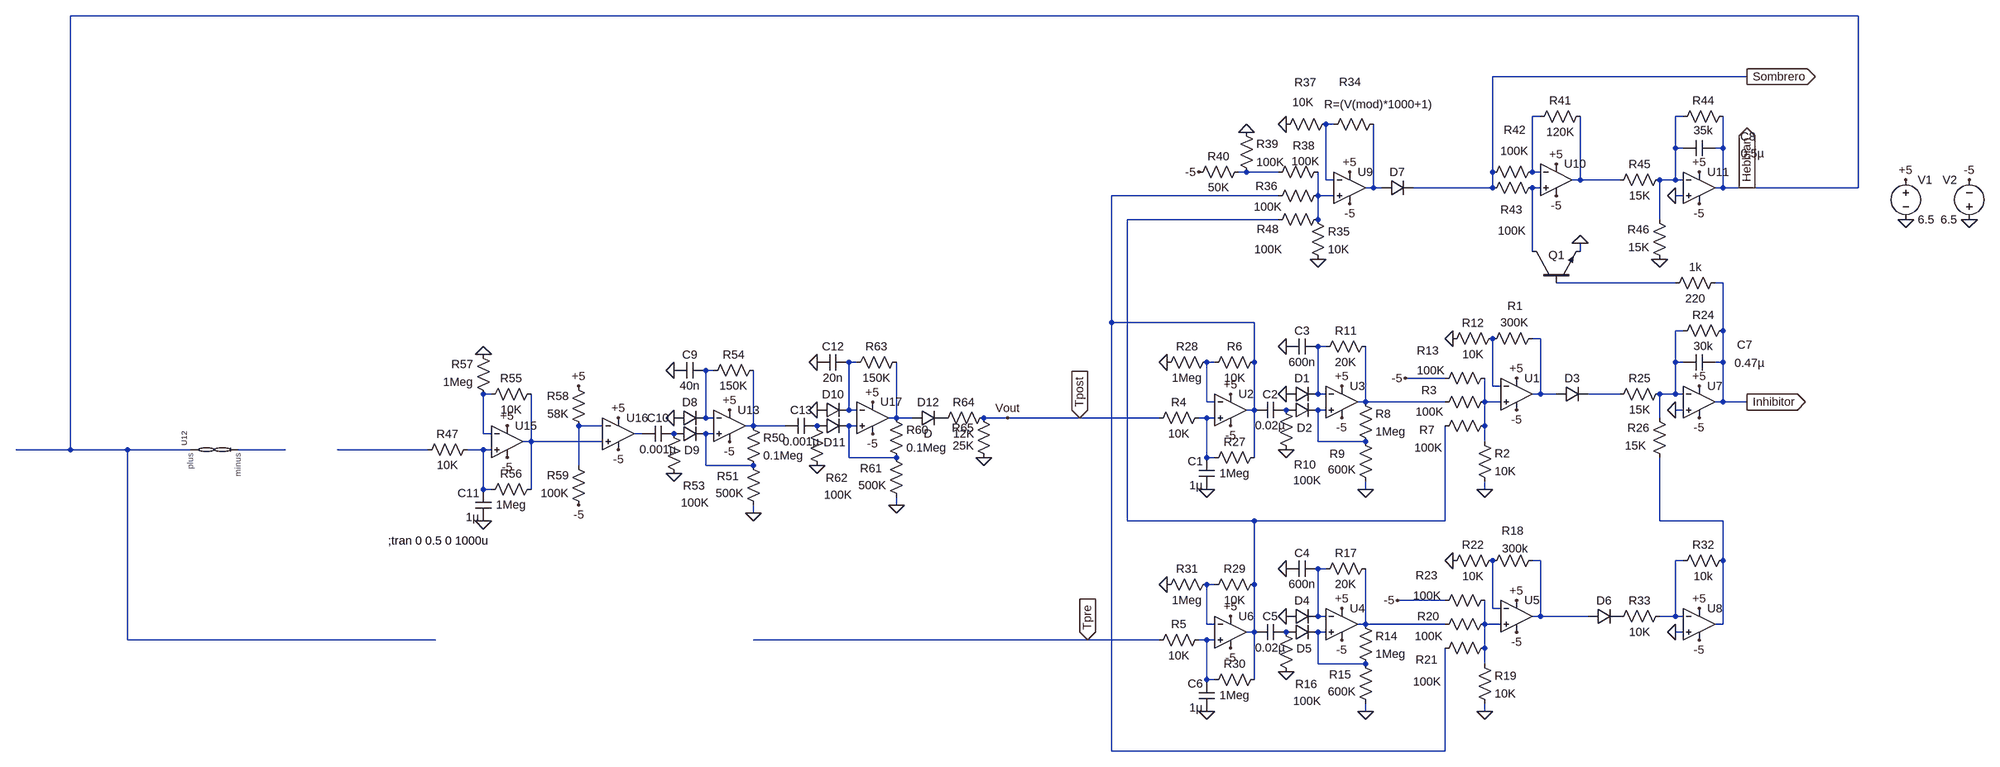
[diagram p0: schematic united_model.asc]
united_model.asc, the LTspice schematic file:
Version 4
SHEET 1 2036 680
WIRE 144 -1360 -4192 -1360
WIRE -80 -944 -592 -944
WIRE -496 -864 -512 -864
WIRE -208 -864 -224 -864
WIRE -912 -848 -928 -848
WIRE -224 -800 -224 -864
WIRE -208 -800 -224 -800
WIRE -128 -800 -128 -864
WIRE -128 -800 -144 -800
WIRE -1088 -752 -1104 -752
WIRE -1024 -752 -1088 -752
WIRE -592 -752 -592 -944
WIRE -512 -752 -512 -864
WIRE -496 -752 -512 -752
WIRE -928 -736 -928 -848
WIRE -912 -736 -928 -736
WIRE -416 -736 -416 -864
WIRE -416 -736 -432 -736
WIRE -336 -736 -416 -736
WIRE -224 -736 -224 -800
WIRE -224 -736 -256 -736
WIRE -208 -736 -224 -736
WIRE -832 -720 -832 -848
WIRE -832 -720 -848 -720
WIRE -816 -720 -832 -720
WIRE -592 -720 -592 -752
WIRE -592 -720 -752 -720
WIRE -496 -720 -512 -720
WIRE -128 -720 -128 -800
WIRE -128 -720 -144 -720
WIRE -80 -720 -128 -720
WIRE 144 -720 144 -1360
WIRE 144 -720 -80 -720
WIRE -1024 -704 -1360 -704
WIRE -944 -704 -944 -752
WIRE -912 -704 -944 -704
WIRE -208 -704 -224 -704
WIRE -1024 -656 -1328 -656
WIRE -944 -656 -944 -704
WIRE -256 -656 -256 -736
WIRE -512 -592 -512 -720
WIRE -416 -592 -416 -608
WIRE -224 -528 -464 -528
WIRE -128 -528 -144 -528
WIRE -1360 -448 -1360 -704
WIRE -1072 -448 -1360 -448
WIRE -208 -432 -224 -432
WIRE -128 -432 -128 -528
WIRE -496 -416 -512 -416
WIRE -928 -400 -944 -400
WIRE -2080 -368 -2096 -368
WIRE -1152 -368 -1168 -368
WIRE -1072 -368 -1072 -448
WIRE -224 -368 -224 -432
WIRE -208 -368 -224 -368
WIRE -128 -368 -128 -432
WIRE -128 -368 -144 -368
WIRE -2368 -352 -2384 -352
WIRE -688 -336 -768 -336
WIRE -592 -320 -592 -416
WIRE -576 -320 -592 -320
WIRE -2816 -304 -2832 -304
WIRE -944 -304 -944 -400
WIRE -928 -304 -944 -304
WIRE -496 -304 -496 -416
WIRE -496 -304 -512 -304
WIRE -464 -304 -496 -304
WIRE -336 -304 -400 -304
WIRE -224 -304 -224 -368
WIRE -224 -304 -256 -304
WIRE -208 -304 -224 -304
WIRE -1168 -288 -1168 -368
WIRE -1152 -288 -1168 -288
WIRE -848 -288 -848 -400
WIRE -848 -288 -864 -288
WIRE -688 -288 -848 -288
WIRE -608 -288 -608 -336
WIRE -576 -288 -608 -288
WIRE -128 -288 -128 -368
WIRE -128 -288 -144 -288
WIRE -80 -288 -128 -288
WIRE -2096 -272 -2096 -368
WIRE -2080 -272 -2096 -272
WIRE -1072 -272 -1072 -368
WIRE -1072 -272 -1088 -272
WIRE -928 -272 -944 -272
WIRE -208 -272 -224 -272
WIRE -2384 -256 -2384 -352
WIRE -2368 -256 -2384 -256
WIRE -2000 -256 -2000 -368
WIRE -2000 -256 -2016 -256
WIRE -1968 -256 -2000 -256
WIRE -1776 -256 -1824 -256
WIRE -1424 -256 -1776 -256
WIRE -1264 -256 -1424 -256
WIRE -1168 -256 -1184 -256
WIRE -1152 -256 -1168 -256
WIRE -256 -256 -256 -304
WIRE -2592 -240 -2640 -240
WIRE -2288 -240 -2288 -352
WIRE -2288 -240 -2304 -240
WIRE -2224 -240 -2288 -240
WIRE -2080 -240 -2096 -240
WIRE -608 -240 -608 -288
WIRE -2832 -224 -2832 -304
WIRE -2816 -224 -2832 -224
WIRE -2512 -224 -2528 -224
WIRE -2368 -224 -2384 -224
WIRE -2736 -208 -2736 -304
WIRE -2736 -208 -2752 -208
WIRE -2592 -208 -2736 -208
WIRE -944 -208 -944 -272
WIRE -848 -208 -944 -208
WIRE -608 -208 -608 -240
WIRE -4192 -192 -4192 -1360
WIRE -4192 -192 -4944 -192
WIRE -3936 -192 -4192 -192
WIRE -3744 -192 -3936 -192
WIRE -3552 -192 -3648 -192
WIRE -2944 -192 -3280 -192
WIRE -2832 -192 -2864 -192
WIRE -2816 -192 -2832 -192
WIRE -2096 -176 -2096 -240
WIRE -2000 -176 -2096 -176
WIRE -1168 -176 -1168 -256
WIRE -1152 -176 -1168 -176
WIRE -1072 -176 -1072 -272
WIRE -2640 -160 -2640 -240
WIRE -2384 -160 -2384 -224
WIRE -2288 -160 -2384 -160
WIRE -2832 -112 -2832 -192
WIRE -2816 -112 -2832 -112
WIRE -2736 -112 -2736 -208
WIRE -848 -112 -848 -128
WIRE -608 -112 -608 -128
WIRE -2000 -80 -2000 -96
WIRE -2288 -64 -2288 -80
WIRE -1328 -48 -1328 -656
WIRE -1072 -48 -1328 -48
WIRE -688 -48 -688 -240
WIRE -688 -48 -1072 -48
WIRE -256 -48 -256 -176
WIRE -128 -48 -256 -48
WIRE -496 32 -512 32
WIRE -208 32 -224 32
WIRE -128 32 -128 -48
WIRE -928 48 -944 48
WIRE -1152 80 -1168 80
WIRE -1072 80 -1072 -48
WIRE -688 112 -784 112
WIRE -592 128 -592 32
WIRE -576 128 -592 128
WIRE -944 144 -944 48
WIRE -928 144 -944 144
WIRE -496 144 -496 32
WIRE -496 144 -512 144
WIRE -400 144 -496 144
WIRE -224 144 -224 32
WIRE -224 144 -256 144
WIRE -208 144 -224 144
WIRE -1168 160 -1168 80
WIRE -1152 160 -1168 160
WIRE -848 160 -848 48
WIRE -848 160 -864 160
WIRE -688 160 -848 160
WIRE -608 160 -608 112
WIRE -576 160 -608 160
WIRE -128 160 -128 32
WIRE -128 160 -144 160
WIRE -1072 176 -1072 80
WIRE -1072 176 -1088 176
WIRE -928 176 -944 176
WIRE -208 176 -224 176
WIRE -3936 192 -3936 -192
WIRE -2928 192 -3936 192
WIRE -1408 192 -2288 192
WIRE -1264 192 -1408 192
WIRE -1168 192 -1184 192
WIRE -1152 192 -1168 192
WIRE -608 208 -608 160
WIRE -944 240 -944 176
WIRE -848 240 -944 240
WIRE -608 240 -608 208
WIRE -1168 272 -1168 192
WIRE -1152 272 -1168 272
WIRE -1072 272 -1072 176
WIRE -848 336 -848 320
WIRE -608 336 -608 320
WIRE -1360 416 -1360 -448
WIRE -688 416 -688 208
WIRE -688 416 -1360 416
FLAG -544 -336 +5
FLAG -544 -272 -5
FLAG -1120 -304 +5
FLAG -1120 -240 -5
FLAG -896 -320 +5
FLAG -896 -256 -5
FLAG -1008 -304 0
FLAG -1008 -400 0
FLAG -1008 -192 0
FLAG -672 -416 0
FLAG -768 -336 -5
FLAG -896 128 +5
FLAG -896 192 -5
FLAG -1008 144 0
FLAG -1008 48 0
FLAG -1008 256 0
FLAG -848 336 0
FLAG -848 -112 0
FLAG -544 112 +5
FLAG -544 176 -5
FLAG -672 32 0
FLAG -784 112 -5
FLAG -1168 -112 0
FLAG -1248 -368 0
FLAG -1120 144 +5
FLAG -1120 208 -5
FLAG -1168 336 0
FLAG -1248 80 0
FLAG -176 -320 +5
FLAG -176 -256 -5
FLAG -176 128 +5
FLAG -176 192 -5
FLAG -224 176 0
FLAG -224 -272 0
FLAG -608 -112 0
FLAG -608 336 0
FLAG -80 -288 Inhibitor
IOPIN -80 -288 Out
FLAG -880 -752 +5
FLAG -880 -688 -5
FLAG -1008 -848 0
FLAG -1088 -832 0
FLAG -464 -768 +5
FLAG -464 -704 -5
FLAG -1184 -752 -5
FLAG -176 -752 +5
FLAG -176 -688 -5
FLAG -224 -704 0
FLAG -256 -576 0
FLAG -416 -608 0
FLAG -80 -720 Hebbian
IOPIN -80 -720 Out
FLAG -80 -944 Sombrero
IOPIN -80 -944 Out
FLAG 240 -656 0
FLAG 368 -656 0
FLAG 368 -736 -5
FLAG 240 -736 +5
FLAG -1424 -256 Tpost
IOPIN -1424 -256 In
FLAG -1408 192 Tpre
IOPIN -1408 192 In
FLAG -944 -576 0
FLAG -2336 -272 +5
FLAG -2336 -208 -5
FLAG -2448 -256 0
FLAG -2448 -352 0
FLAG -2448 -144 0
FLAG -2288 -64 0
FLAG -2784 -240 +5
FLAG -2784 -176 -5
FLAG -2832 -48 0
FLAG -2832 -384 0
FLAG -2560 -256 +5
FLAG -2560 -192 -5
FLAG -2640 -80 -5
FLAG -2640 -320 +5
FLAG -2048 -288 +5
FLAG -2048 -224 -5
FLAG -2160 -272 0
FLAG -2160 -368 0
FLAG -2160 -160 0
FLAG -2000 -80 0
FLAG -1824 -176 0
FLAG -1776 -256 Vout
SYMBOL Opamps\\UniversalOpamp2 -544 -304 R0
SYMATTR InstName U1
SYMBOL res -496 -432 R90
WINDOW 0 -34 51 VBottom 2
WINDOW 3 -32 52 VTop 2
SYMATTR InstName R1
SYMATTR Value 300K
SYMBOL res -624 -224 R0
SYMATTR InstName R2
SYMATTR Value 10K
SYMBOL res -592 -304 R90
WINDOW 0 8 128 VBottom 2
WINDOW 3 20 127 VTop 2
SYMATTR InstName R3
SYMATTR Value 100K
SYMBOL Opamps\\UniversalOpamp2 -1120 -272 R0
SYMATTR InstName U2
SYMBOL cap -1152 -112 R180
WINDOW 0 24 56 Left 2
WINDOW 3 24 8 Left 2
SYMATTR InstName C1
SYMATTR Value 1µ
SYMBOL res -1168 -272 R90
WINDOW 0 0 56 VBottom 2
WINDOW 3 32 56 VTop 2
SYMATTR InstName R4
SYMATTR Value 10K
SYMBOL res -1168 176 R90
WINDOW 0 0 56 VBottom 2
WINDOW 3 32 56 VTop 2
SYMATTR InstName R5
SYMATTR Value 10K
SYMBOL res -1056 -384 R90
WINDOW 0 0 56 VBottom 2
WINDOW 3 32 56 VTop 2
SYMATTR InstName R6
SYMATTR Value 10K
SYMBOL res -592 -256 R90
WINDOW 0 40 132 VBottom 2
WINDOW 3 45 130 VTop 2
SYMATTR InstName R7
SYMATTR Value 100K
SYMBOL Opamps\\UniversalOpamp2 -896 -288 R0
SYMATTR InstName U3
SYMBOL diode -1008 -288 R270
WINDOW 0 32 32 VTop 2
WINDOW 3 0 32 Invisible 2
SYMATTR InstName D1
SYMBOL diode -1008 -256 R270
WINDOW 0 -36 37 VTop 2
WINDOW 3 0 32 Invisible 2
SYMATTR InstName D2
SYMBOL res -864 -304 R0
SYMATTR InstName R8
SYMATTR Value 1Meg
SYMBOL res -832 -112 R180
WINDOW 0 58 71 Left 2
WINDOW 3 36 40 Left 2
SYMATTR InstName R9
SYMATTR Value 600K
SYMBOL res -1024 -288 R0
WINDOW 0 32 126 Left 2
WINDOW 3 30 158 Left 2
SYMATTR InstName R10
SYMATTR Value 100K
SYMBOL cap -1008 -288 R90
WINDOW 0 0 32 VBottom 2
WINDOW 3 32 32 VTop 2
SYMATTR InstName C2
SYMATTR Value 0.02µ
SYMBOL res -832 -416 R90
WINDOW 0 0 56 VBottom 2
WINDOW 3 32 56 VTop 2
SYMATTR InstName R11
SYMATTR Value 20K
SYMBOL cap -944 -416 R90
WINDOW 0 0 32 VBottom 2
WINDOW 3 32 32 VTop 2
SYMATTR InstName C3
SYMATTR Value 600n
SYMBOL res -688 -400 R270
WINDOW 0 32 56 VTop 2
WINDOW 3 0 56 VBottom 2
SYMATTR InstName R12
SYMATTR Value 10K
SYMBOL diode -464 -288 R270
WINDOW 0 32 32 VTop 2
WINDOW 3 0 32 Invisible 2
SYMATTR InstName D3
SYMBOL res -592 -352 R90
WINDOW 0 -24 131 VBottom 2
WINDOW 3 -15 125 VTop 2
SYMATTR InstName R13
SYMATTR Value 100K
SYMBOL Opamps\\UniversalOpamp2 -896 160 R0
SYMATTR InstName U4
SYMBOL diode -1008 160 R270
WINDOW 0 32 32 VTop 2
WINDOW 3 0 32 Invisible 2
SYMATTR InstName D4
SYMBOL diode -1008 192 R270
WINDOW 0 -33 36 VTop 2
WINDOW 3 0 32 Invisible 2
SYMATTR InstName D5
SYMBOL res -864 144 R0
SYMATTR InstName R14
SYMATTR Value 1Meg
SYMBOL res -832 336 R180
WINDOW 0 45 74 Left 2
WINDOW 3 36 40 Left 2
SYMATTR InstName R15
SYMATTR Value 600K
SYMBOL res -1024 160 R0
WINDOW 0 34 121 Left 2
WINDOW 3 30 155 Left 2
SYMATTR InstName R16
SYMATTR Value 100K
SYMBOL res -832 32 R90
WINDOW 0 0 56 VBottom 2
WINDOW 3 32 56 VTop 2
SYMATTR InstName R17
SYMATTR Value 20K
SYMBOL cap -944 32 R90
WINDOW 0 0 32 VBottom 2
WINDOW 3 32 32 VTop 2
SYMATTR InstName C4
SYMATTR Value 600n
SYMBOL cap -1008 160 R90
WINDOW 0 0 32 VBottom 2
WINDOW 3 32 32 VTop 2
SYMATTR InstName C5
SYMATTR Value 0.02µ
SYMBOL Opamps\\UniversalOpamp2 -544 144 R0
SYMATTR InstName U5
SYMBOL res -496 16 R90
WINDOW 0 -29 56 VBottom 2
WINDOW 3 -24 51 VTop 2
SYMATTR InstName R18
SYMATTR Value 300k
SYMBOL res -624 224 R0
SYMATTR InstName R19
SYMATTR Value 10K
SYMBOL res -592 144 R90
WINDOW 0 16 130 VBottom 2
WINDOW 3 25 129 VTop 2
SYMATTR InstName R20
SYMATTR Value 100K
SYMBOL res -592 192 R90
WINDOW 0 55 133 VBottom 2
WINDOW 3 68 132 VTop 2
SYMATTR InstName R21
SYMATTR Value 100K
SYMBOL res -688 48 R270
WINDOW 0 32 56 VTop 2
WINDOW 3 0 56 VBottom 2
SYMATTR InstName R22
SYMATTR Value 10K
SYMBOL diode -400 160 R270
WINDOW 0 32 32 VTop 2
WINDOW 3 0 32 Invisible 2
SYMATTR InstName D6
SYMBOL res -592 96 R90
WINDOW 0 -19 133 VBottom 2
WINDOW 3 -9 132 VTop 2
SYMATTR InstName R23
SYMATTR Value 100K
SYMBOL res -112 -448 R90
WINDOW 0 0 56 VBottom 2
WINDOW 3 32 56 VTop 2
SYMATTR InstName R24
SYMATTR Value 30k
SYMBOL res -240 -320 R90
WINDOW 0 0 56 VBottom 2
WINDOW 3 32 56 VTop 2
SYMATTR InstName R25
SYMATTR Value 15K
SYMBOL res -240 -160 R180
WINDOW 0 36 76 Left 2
WINDOW 3 43 40 Left 2
SYMATTR InstName R26
SYMATTR Value 15K
SYMBOL res -1056 -192 R90
WINDOW 0 0 56 VBottom 2
WINDOW 3 32 56 VTop 2
SYMATTR InstName R27
SYMATTR Value 1Meg
SYMBOL res -1152 -384 R90
WINDOW 0 0 56 VBottom 2
WINDOW 3 32 56 VTop 2
SYMATTR InstName R28
SYMATTR Value 1Meg
SYMBOL Opamps\\UniversalOpamp2 -1120 176 R0
SYMATTR InstName U6
SYMBOL cap -1152 336 R180
WINDOW 0 24 56 Left 2
WINDOW 3 24 8 Left 2
SYMATTR InstName C6
SYMATTR Value 1µ
SYMBOL res -1056 64 R90
WINDOW 0 0 56 VBottom 2
WINDOW 3 32 56 VTop 2
SYMATTR InstName R29
SYMATTR Value 10K
SYMBOL res -1056 256 R90
WINDOW 0 0 56 VBottom 2
WINDOW 3 32 56 VTop 2
SYMATTR InstName R30
SYMATTR Value 1Meg
SYMBOL res -1152 64 R90
WINDOW 0 0 56 VBottom 2
WINDOW 3 32 56 VTop 2
SYMATTR InstName R31
SYMATTR Value 1Meg
SYMBOL Opamps\\UniversalOpamp2 -176 -288 R0
SYMATTR InstName U7
SYMBOL res -112 16 R90
WINDOW 0 0 56 VBottom 2
WINDOW 3 32 56 VTop 2
SYMATTR InstName R32
SYMATTR Value 10k
SYMBOL Opamps\\UniversalOpamp2 -176 160 R0
SYMATTR InstName U8
SYMBOL res -240 128 R90
WINDOW 0 0 56 VBottom 2
WINDOW 3 32 56 VTop 2
SYMATTR InstName R33
SYMATTR Value 10K
SYMBOL cap -144 -384 R90
WINDOW 0 -4 -60 VBottom 2
WINDOW 3 2 -70 VTop 2
SYMATTR InstName C7
SYMATTR Value 0.47µ
SYMBOL Opamps\\UniversalOpamp2 -880 -720 R0
SYMATTR InstName U9
SYMATTR SpiceModel level.3a
SYMBOL res -816 -864 R90
WINDOW 0 -54 63 VBottom 2
WINDOW 3 -40 6 VTop 2
SYMATTR InstName R34
SYMATTR Value R=(V(mod)*1000+1)
SYMBOL res -960 -672 R0
SYMATTR InstName R35
SYMATTR Value 10K
SYMBOL res -928 -720 R90
WINDOW 0 12 120 VBottom 2
WINDOW 3 23 117 VTop 2
SYMATTR InstName R36
SYMATTR Value 100K
SYMBOL res -1024 -832 R270
WINDOW 0 85 55 VTop 2
WINDOW 3 76 50 VBottom 2
SYMATTR InstName R37
SYMATTR Value 10K
SYMBOL res -928 -768 R90
WINDOW 0 -21 45 VBottom 2
WINDOW 3 -21 41 VTop 2
SYMATTR InstName R38
SYMATTR Value 100K
SYMBOL res -1104 -848 R0
SYMATTR InstName R39
SYMATTR Value 100K
SYMBOL res -1088 -768 R90
WINDOW 0 0 56 VBottom 2
WINDOW 3 32 56 VTop 2
SYMATTR InstName R40
SYMATTR Value 50K
SYMBOL diode -816 -704 R270
WINDOW 0 32 32 VTop 2
WINDOW 3 0 32 Invisible 2
SYMATTR InstName D7
SYMBOL res -400 -880 R90
WINDOW 0 0 56 VBottom 2
WINDOW 3 32 56 VTop 2
SYMATTR InstName R41
SYMATTR Value 120K
SYMBOL Opamps\\UniversalOpamp2 -464 -736 R0
SYMATTR InstName U10
SYMBOL res -496 -768 R90
WINDOW 0 -53 52 VBottom 2
WINDOW 3 -42 52 VTop 2
SYMATTR InstName R42
SYMATTR Value 100K
SYMBOL res -496 -736 R90
WINDOW 0 76 58 VBottom 2
WINDOW 3 87 57 VTop 2
SYMATTR InstName R43
SYMATTR Value 100K
SYMBOL npn -512 -528 R270
WINDOW 0 56 32 VRight 2
WINDOW 3 56 68 Invisible 2
SYMATTR InstName Q1
SYMATTR Value BC547B
SYMBOL res -112 -880 R90
WINDOW 0 0 56 VBottom 2
WINDOW 3 60 56 VBottom 2
SYMATTR InstName R44
SYMATTR Value 35k
SYMBOL res -240 -752 R90
WINDOW 0 0 56 VBottom 2
WINDOW 3 32 56 VTop 2
SYMATTR InstName R45
SYMATTR Value 15K
SYMBOL res -240 -560 R180
WINDOW 0 36 76 Left 2
WINDOW 3 36 40 Left 2
SYMATTR InstName R46
SYMATTR Value 15K
SYMBOL Opamps\\UniversalOpamp2 -176 -720 R0
SYMATTR InstName U11
SYMBOL cap -144 -816 R90
WINDOW 0 8 -66 VBottom 2
WINDOW 3 11 -75 VTop 2
SYMATTR InstName C8
SYMATTR Value 0.5µ
SYMBOL res -240 -512 R270
WINDOW 0 32 56 VTop 2
WINDOW 3 0 56 VBottom 2
SYMATTR InstName 1k
SYMATTR Value 220
SYMBOL voltage 240 -752 R0
WINDOW 123 0 0 Left 2
WINDOW 39 0 0 Left 2
SYMATTR InstName V1
SYMATTR Value 6.5
SYMBOL voltage 368 -640 R180
WINDOW 0 24 96 Left 2
WINDOW 3 24 16 Left 2
WINDOW 123 0 0 Left 2
WINDOW 39 0 0 Left 2
SYMATTR InstName V2
SYMATTR Value 6.5
SYMBOL res -928 -672 R90
WINDOW 0 51 117 VBottom 2
WINDOW 3 61 116 VTop 2
SYMATTR InstName R48
SYMATTR Value 100K
SYMBOL res -2848 -208 R90
WINDOW 0 0 56 VBottom 2
WINDOW 3 32 56 VTop 2
SYMATTR InstName R47
SYMATTR Value 10K
SYMBOL Opamps\\UniversalOpamp2 -2336 -240 R0
SYMATTR InstName U13
SYMBOL diode -2448 -240 R270
WINDOW 0 32 32 VTop 2
WINDOW 3 0 32 Invisible 2
SYMATTR InstName D8
SYMBOL diode -2448 -208 R270
WINDOW 0 -33 36 VTop 2
WINDOW 3 0 32 Invisible 2
SYMATTR InstName D9
SYMBOL res -2304 -256 R0
SYMATTR InstName R50
SYMATTR Value 0.1Meg
SYMBOL res -2272 -64 R180
WINDOW 0 45 74 Left 2
WINDOW 3 36 40 Left 2
SYMATTR InstName R51
SYMATTR Value 500K
SYMBOL res -2464 -240 R0
WINDOW 0 34 121 Left 2
WINDOW 3 30 155 Left 2
SYMATTR InstName R53
SYMATTR Value 100K
SYMBOL res -2272 -368 R90
WINDOW 0 0 56 VBottom 2
WINDOW 3 32 56 VTop 2
SYMATTR InstName R54
SYMATTR Value 150K
SYMBOL cap -2384 -368 R90
WINDOW 0 0 32 VBottom 2
WINDOW 3 32 32 VTop 2
SYMATTR InstName C9
SYMATTR Value 40n
SYMBOL cap -2448 -240 R90
WINDOW 0 0 32 VBottom 2
WINDOW 3 32 32 VTop 2
SYMATTR InstName C10
SYMATTR Value 0.001µ
SYMBOL Opamps\\UniversalOpamp2 -2784 -208 R0
SYMATTR InstName U15
SYMBOL cap -2816 -48 R180
WINDOW 0 24 56 Left 2
WINDOW 3 24 8 Left 2
SYMATTR InstName C11
SYMATTR Value 1µ
SYMBOL res -2720 -320 R90
WINDOW 0 0 56 VBottom 2
WINDOW 3 32 56 VTop 2
SYMATTR InstName R55
SYMATTR Value 10K
SYMBOL res -2720 -128 R90
WINDOW 0 0 56 VBottom 2
WINDOW 3 32 56 VTop 2
SYMATTR InstName R56
SYMATTR Value 1Meg
SYMBOL res -2816 -288 R180
WINDOW 0 36 76 Left 2
WINDOW 3 36 40 Left 2
SYMATTR InstName R57
SYMATTR Value 1Meg
SYMBOL Opamps\\UniversalOpamp2 -2560 -224 R0
SYMATTR InstName U16
SYMBOL res -2624 -224 R180
WINDOW 0 36 76 Left 2
WINDOW 3 36 40 Left 2
SYMATTR InstName R58
SYMATTR Value 58K
SYMBOL res -2624 -64 R180
WINDOW 0 36 76 Left 2
WINDOW 3 36 40 Left 2
SYMATTR InstName R59
SYMATTR Value 100K
SYMBOL Opamps\\UniversalOpamp2 -2048 -256 R0
SYMATTR InstName U17
SYMBOL diode -2160 -256 R270
WINDOW 0 32 32 VTop 2
WINDOW 3 0 32 Invisible 2
SYMATTR InstName D10
SYMBOL diode -2160 -224 R270
WINDOW 0 -33 36 VTop 2
WINDOW 3 0 32 Invisible 2
SYMATTR InstName D11
SYMBOL res -2016 -272 R0
SYMATTR InstName R60
SYMATTR Value 0.1Meg
SYMBOL res -1984 -80 R180
WINDOW 0 45 74 Left 2
WINDOW 3 36 40 Left 2
SYMATTR InstName R61
SYMATTR Value 500K
SYMBOL res -2176 -256 R0
WINDOW 0 34 121 Left 2
WINDOW 3 30 155 Left 2
SYMATTR InstName R62
SYMATTR Value 100K
SYMBOL res -1984 -384 R90
WINDOW 0 0 56 VBottom 2
WINDOW 3 32 56 VTop 2
SYMATTR InstName R63
SYMATTR Value 150K
SYMBOL cap -2096 -384 R90
WINDOW 0 0 32 VBottom 2
WINDOW 3 32 32 VTop 2
SYMATTR InstName C12
SYMATTR Value 20n
SYMBOL cap -2160 -256 R90
WINDOW 0 0 32 VBottom 2
WINDOW 3 32 32 VTop 2
SYMATTR InstName C13
SYMATTR Value 0.001µ
SYMBOL diode -1968 -240 R270
WINDOW 0 32 32 VTop 2
WINDOW 3 0 32 VBottom 2
SYMATTR InstName D12
SYMBOL res -1808 -272 R90
WINDOW 0 0 56 VBottom 2
WINDOW 3 32 56 VTop 2
SYMATTR InstName R64
SYMATTR Value 12K
SYMBOL res -1808 -160 R180
WINDOW 0 36 76 Left 2
WINDOW 3 36 40 Left 2
SYMATTR InstName R65
SYMATTR Value 25K
SYMBOL memristor -3696 -192 R270
SYMATTR InstName U12
TEXT -3024 -8 Left 2 !;tran 0 0.5 0 1000u

The netlist it stands for:
* united_model.asc
XU1 N022 N018 +5 -5 N013 level.2 Avol=1Meg GBW=10Meg Slew=10Meg ilimit=25m rail=0 Vos=0 phimargin=45 en=0 enk=0 in=0 ink=0 Rin=500Meg  ; pins IN+ IN- V+ V- OUT
R1 N013 N018 300K
R2 N022 0 10K
R3 N022 N021 100K
XU2 N025 N016 +5 -5 N008 level.2 Avol=1Meg GBW=10Meg Slew=10Meg ilimit=25m rail=0 Vos=0 phimargin=45 en=0 enk=0 in=0 ink=0 Rin=500Meg  ; pins IN+ IN- V+ V- OUT
C1 0 N025 1µ
R4 N025 Vout 10K
R5 N044 Tpre 10K
R6 N008 N016 10K
R7 N022 N010 100K
XU3 N023 N014 +5 -5 N021 level.2 Avol=1Meg GBW=10Meg Slew=10Meg ilimit=25m rail=0 Vos=0 phimargin=45 en=0 enk=0 in=0 ink=0 Rin=500Meg  ; pins IN+ IN- V+ V- OUT
D1 0 N014 D
D2 P001 N023 D
R8 N021 N023 1Meg
R9 0 N023 600K
R10 P001 0 100K
C2 P001 N008 0.02µ
R11 N021 N014 20K
C3 N014 0 600n
R12 0 N018 10K
D3 N013 N020 D
R13 N022 -5 100K
XU4 N043 N038 +5 -5 N041 level.2 Avol=1Meg GBW=10Meg Slew=10Meg ilimit=25m rail=0 Vos=0 phimargin=45 en=0 enk=0 in=0 ink=0 Rin=500Meg  ; pins IN+ IN- V+ V- OUT
D4 0 N038 D
D5 P002 N043 D
R14 N041 N043 1Meg
R15 0 N043 600K
R16 P002 0 100K
R17 N041 N038 20K
C4 N038 0 600n
C5 P002 N010 0.02µ
XU5 N042 N040 +5 -5 N036 level.2 Avol=1Meg GBW=10Meg Slew=10Meg ilimit=25m rail=0 Vos=0 phimargin=45 en=0 enk=0 in=0 ink=0 Rin=500Meg  ; pins IN+ IN- V+ V- OUT
R18 N036 N040 300k
R19 N042 0 10K
R20 N042 N041 100K
R21 N042 N008 100K
R22 0 N040 10K
D6 N036 P003 D
R23 N042 -5 100K
R24 Inhibitor N012 30k
R25 N012 N020 15K
R26 N035 N012 15K
R27 N008 N025 1Meg
R28 N016 0 1Meg
XU6 N044 N039 +5 -5 N010 level.2 Avol=1Meg GBW=10Meg Slew=10Meg ilimit=25m rail=0 Vos=0 phimargin=45 en=0 enk=0 in=0 ink=0 Rin=500Meg  ; pins IN+ IN- V+ V- OUT
C6 0 N044 1µ
R29 N010 N039 10K
R30 N010 N044 1Meg
R31 N039 0 1Meg
XU7 0 N012 +5 -5 Inhibitor level.2 Avol=1Meg GBW=10Meg Slew=10Meg ilimit=25m rail=0 Vos=0 phimargin=45 en=0 enk=0 in=0 ink=0 Rin=500Meg  ; pins IN+ IN- V+ V- OUT
R32 N035 N037 10k
XU8 0 N037 +5 -5 N035 level.2 Avol=1Meg GBW=10Meg Slew=10Meg ilimit=25m rail=0 Vos=0 phimargin=45 en=0 enk=0 in=0 ink=0 Rin=500Meg  ; pins IN+ IN- V+ V- OUT
R33 N037 P003 10K
C7 Inhibitor N012 0.47µ
XU9 N009 N003 +5 -5 N006 level.3a Avol=1Meg GBW=10Meg Slew=10Meg ilimit=25m rail=0 Vos=0 phimargin=45 en=0 enk=0 in=0 ink=0 Rin=500Meg  ; pins IN+ IN- V+ V- OUT
R34 N006 N003 R=(V(mod)*1000+1)
R35 N009 0 10K
R36 N009 N008 100K
R37 0 N003 10K
R38 N009 N004 100K
R39 0 N004 100K
R40 N004 -5 50K
D7 N006 Sombrero D
R41 N005 N001 120K
XU10 N007 N001 +5 -5 N005 level.2 Avol=1Meg GBW=10Meg Slew=10Meg ilimit=25m rail=0 Vos=0 phimargin=45 en=0 enk=0 in=0 ink=0 Rin=500Meg  ; pins IN+ IN- V+ V- OUT
R42 N001 Sombrero 100K
R43 N007 Sombrero 100K
Q1 N007 N011 0 0 BC547B
R44 Hebbian N002 35k
R45 N002 N005 15K
R46 0 N002 15K
XU11 0 N002 +5 -5 Hebbian level.2 Avol=1Meg GBW=10Meg Slew=10Meg ilimit=25m rail=0 Vos=0 phimargin=45 en=0 enk=0 in=0 ink=0 Rin=500Meg  ; pins IN+ IN- V+ V- OUT
C8 Hebbian N002 0.5µ
R§1k N011 Inhibitor 220
V1 +5 0 6.5
V2 0 -5 6.5
R48 N009 N010 100K
R47 N034 N033 10K
XU13 N030 N017 +5 -5 N027 level.2 Avol=1Meg GBW=10Meg Slew=10Meg ilimit=25m rail=0 Vos=0 phimargin=45 en=0 enk=0 in=0 ink=0 Rin=500Meg  ; pins IN+ IN- V+ V- OUT
D8 0 N017 D
D9 P004 N030 D
R50 N027 N030 0.1Meg
R51 0 N030 500K
R53 P004 0 100K
R54 N027 N017 150K
C9 N017 0 40n
C10 P004 N029 0.001µ
XU15 N034 N019 +5 -5 N031 level.2 Avol=1Meg GBW=10Meg Slew=10Meg ilimit=25m rail=0 Vos=0 phimargin=45 en=0 enk=0 in=0 ink=0 Rin=500Meg  ; pins IN+ IN- V+ V- OUT
C11 0 N034 1µ
R55 N031 N019 10K
R56 N031 N034 1Meg
R57 N019 0 1Meg
XU16 N031 N026 +5 -5 N029 level.2 Avol=1Meg GBW=10Meg Slew=10Meg ilimit=25m rail=0 Vos=0 phimargin=45 en=0 enk=0 in=0 ink=0 Rin=500Meg  ; pins IN+ IN- V+ V- OUT
R58 N026 +5 58K
R59 -5 N026 100K
XU17 N028 N015 +5 -5 N024 level.2 Avol=1Meg GBW=10Meg Slew=10Meg ilimit=25m rail=0 Vos=0 phimargin=45 en=0 enk=0 in=0 ink=0 Rin=500Meg  ; pins IN+ IN- V+ V- OUT
D10 0 N015 D
D11 P005 N028 D
R60 N024 N028 0.1Meg
R61 0 N028 500K
R62 P005 0 100K
R63 N024 N015 150K
C12 N015 0 20n
C13 P005 N027 0.001µ
D12 N024 P006 D
R64 Vout P006 12K
R65 0 Vout 25K
XU12 Hebbian N032 memristor  ; pins plus minus
.model D D
.lib standard.dio
.model NPN NPN
.model PNP PNP
.lib standard.bjt
;tran 0 0.5 0 1000u
.lib UniversalOpamps2.sub
.lib memristor.sub
.backanno
.end